# EAGLE schematic multiMicro_base_64pin (EAGLE 6.1)
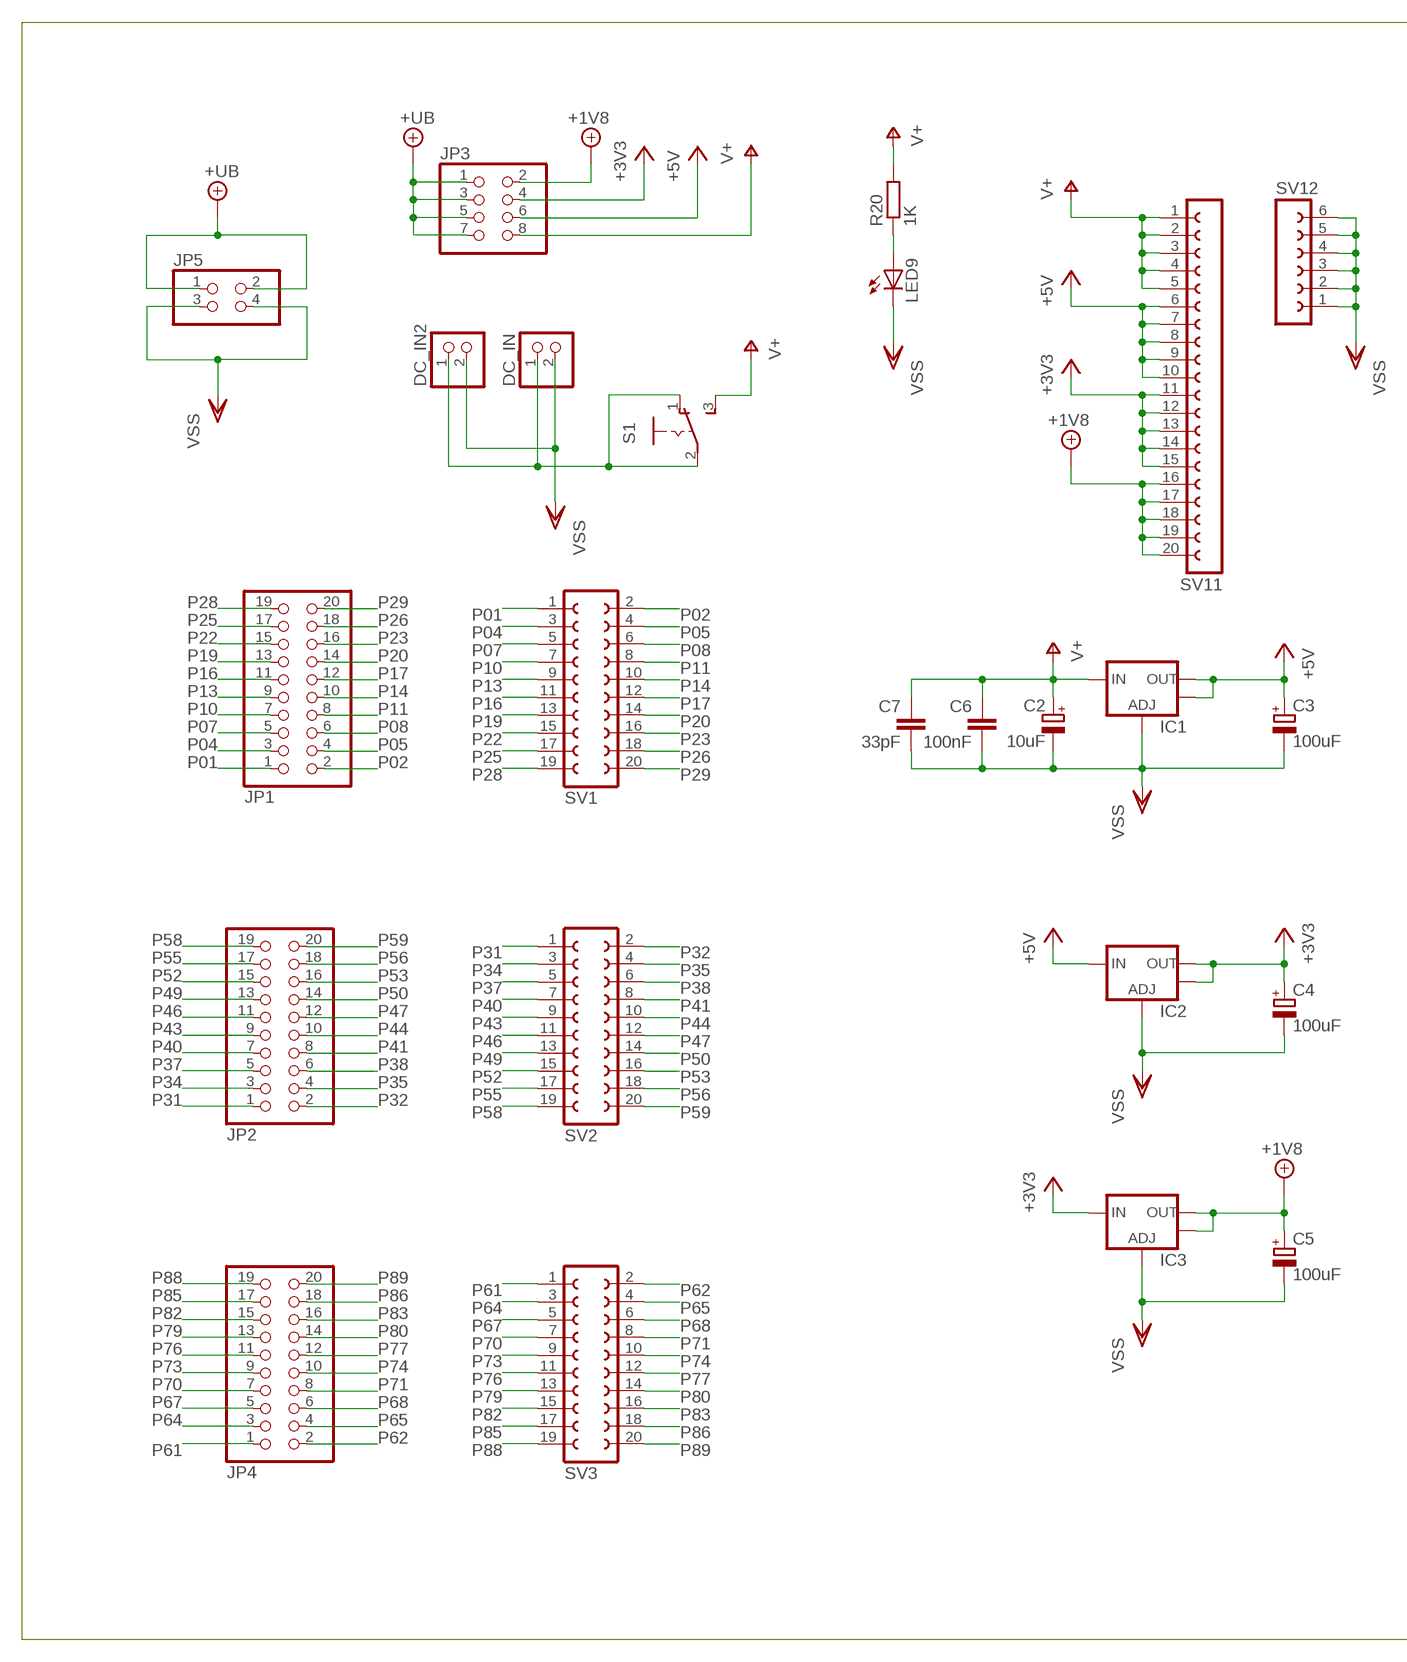
[diagram p0: schematic, sheet 1, part 1 of 2]
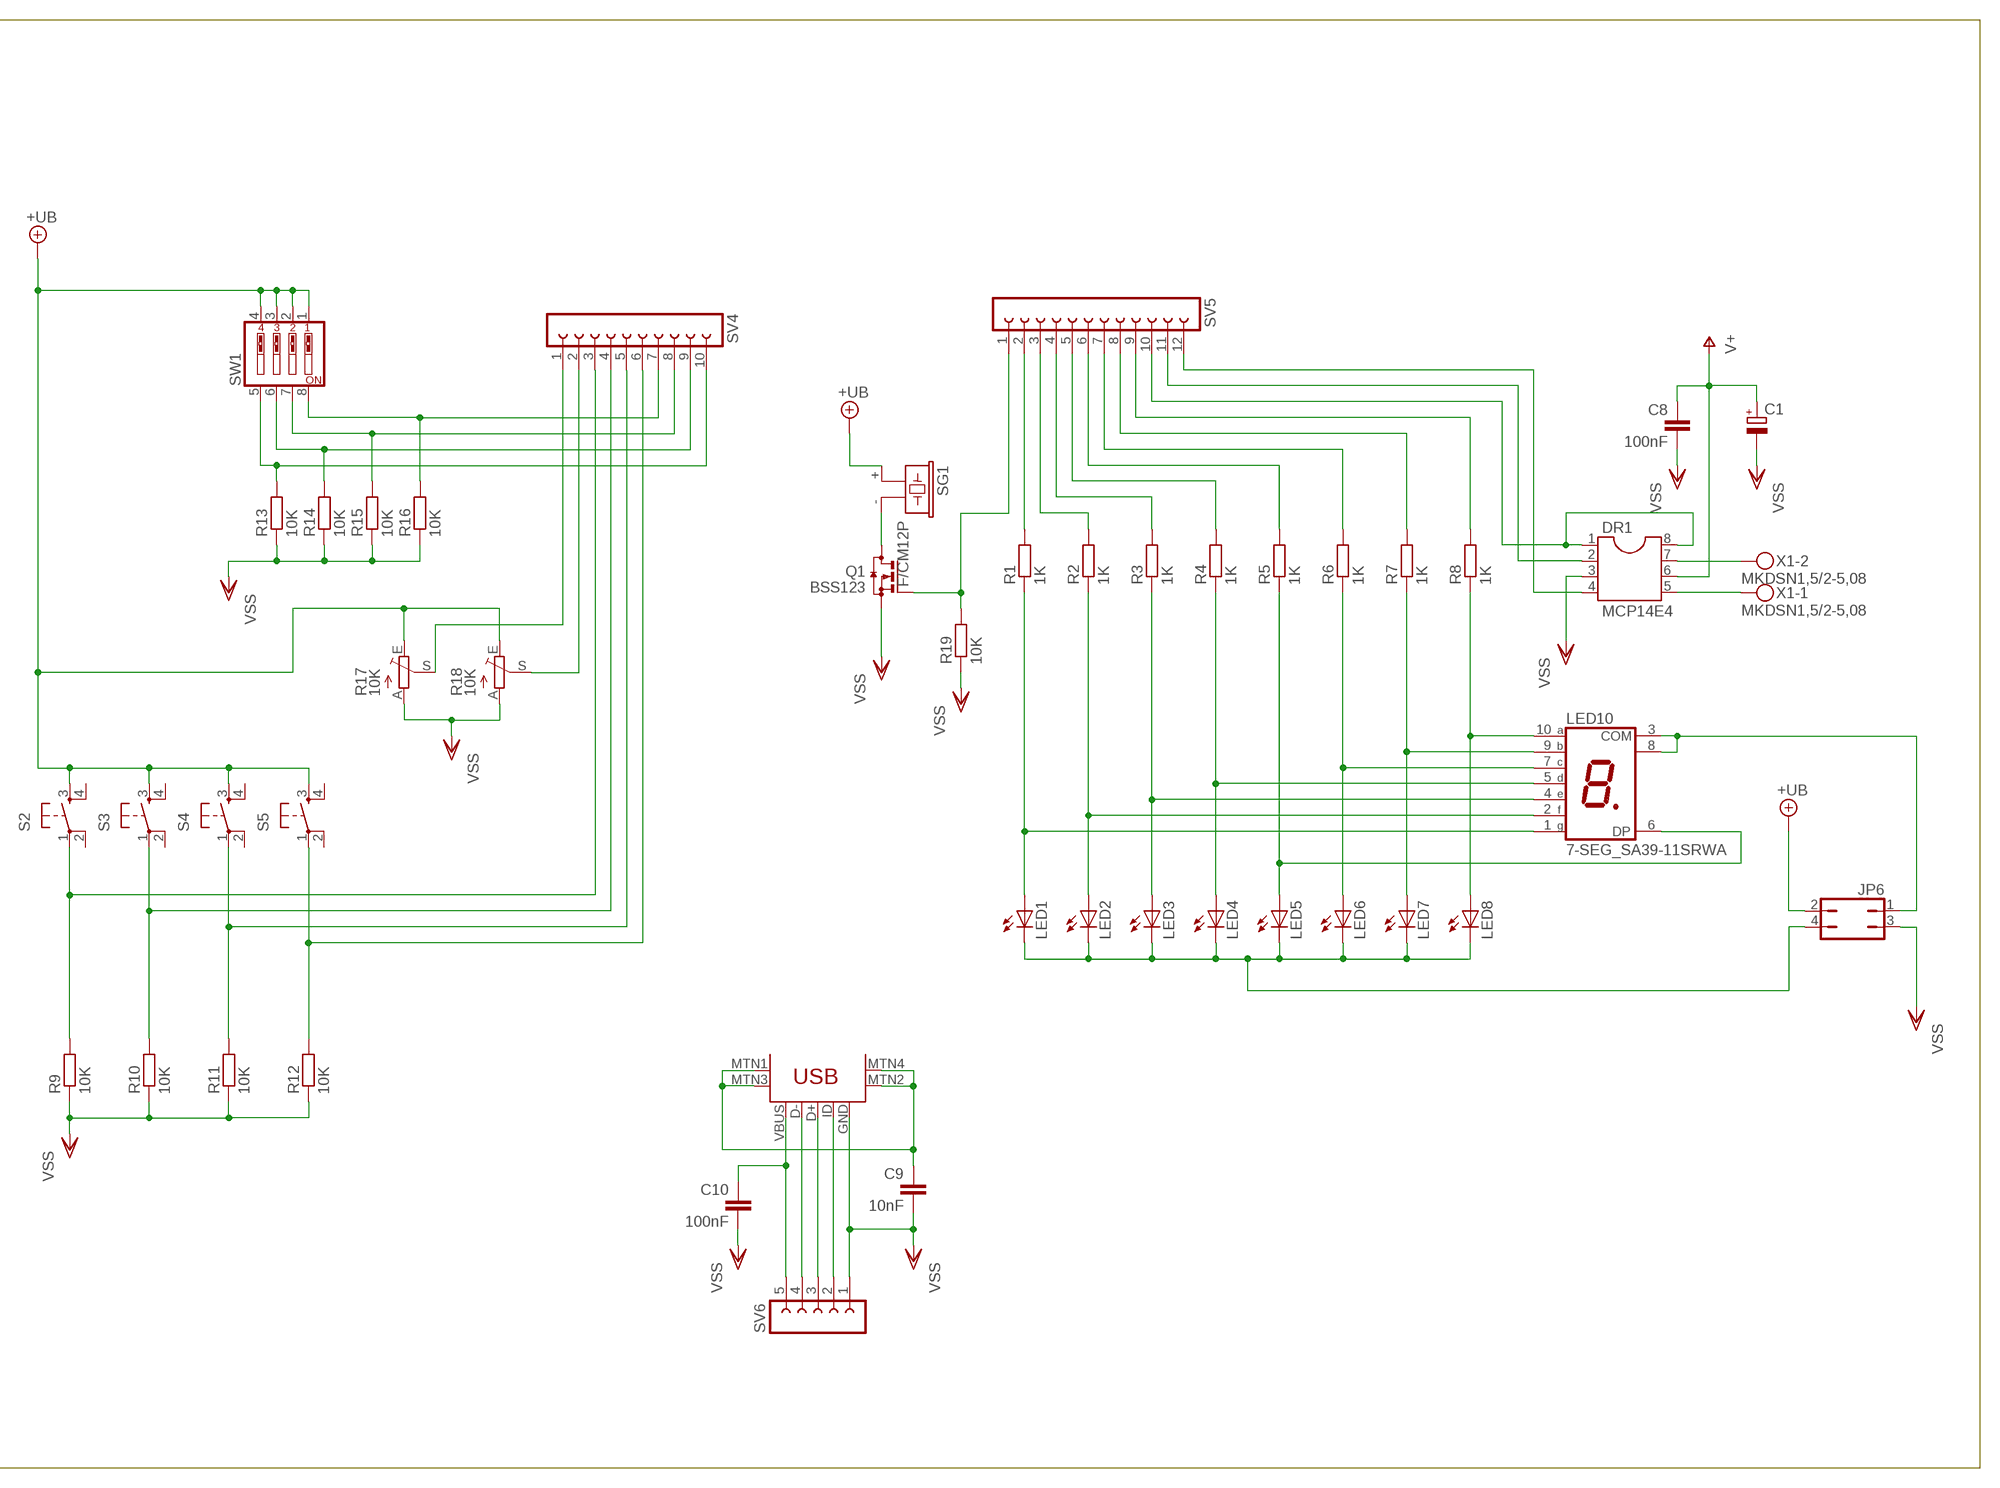
[diagram p1: schematic, sheet 1, part 2 of 2]

## Parts
C1  CPOL-EU140CLH-0810  [140CLH-0810]
C2  10uF  CPOL-EUSMCC  [SMC_C]
C3  100uF  CPOL-EUCT7343  [CT7343]
C4  100uF  CPOL-EUCT7343  [CT7343]
C5  100uF  CPOL-EUCT7343  [CT7343]
C6  100nF  C-EUC0805  [C0805]
C7  33pF  C-EUC0805  [C0805]
C8  100nF  C-EUC0805  [C0805]
C9  10nF  C-EUC0805  [C0805]
C10  100nF  C-EUC0805  [C0805]
DC_IN  PINHD-1X2/90  [1X02/90]
DC_IN2  PINHD-1X2/90  [1X02/90]
DR1  MCP14E4  SOIC08  [SOIC08]
IC1  V_REG_LM1117SOT223  [SOT223]
IC2  V_REG_LM1117SOT223  [SOT223]
IC3  V_REG_LM1117SOT223  [SOT223]
JP1  PINHD-2X10/90  [2X10/90]
JP2  PINHD-2X10/90  [2X10/90]
JP3  PINHD-2X4  [2X04]
JP4  PINHD-2X10/90  [2X10/90]
JP5  PINHD-2X2/90  [2X02/90]
JP6  JP2Q  [JP2Q]
LED1  LEDCHIP-LED0805  [CHIP-LED0805]
LED2  LEDCHIP-LED0805  [CHIP-LED0805]
LED3  LEDCHIP-LED0805  [CHIP-LED0805]
LED4  LEDCHIP-LED0805  [CHIP-LED0805]
LED5  LEDCHIP-LED0805  [CHIP-LED0805]
LED6  LEDCHIP-LED0805  [CHIP-LED0805]
LED7  LEDCHIP-LED0805  [CHIP-LED0805]
LED8  LEDCHIP-LED0805  [CHIP-LED0805]
LED9  LEDCHIP-LED0805  [CHIP-LED0805]
LED10  7-SEG_SA39-11SRWA  [SA39-11SRWA]
Q1  BSS123  [SOT23]
R1  1K  R-EU_R0805  [R0805]
R2  1K  R-EU_R0805  [R0805]
R3  1K  R-EU_R0805  [R0805]
R4  1K  R-EU_R0805  [R0805]
R5  1K  R-EU_R0805  [R0805]
R6  1K  R-EU_R0805  [R0805]
R7  1K  R-EU_R0805  [R0805]
R8  1K  R-EU_R0805  [R0805]
R9  10K  R-EU_R0805  [R0805]
R10  10K  R-EU_R0805  [R0805]
R11  10K  R-EU_R0805  [R0805]
R12  10K  R-EU_R0805  [R0805]
R13  10K  R-EU_R0805  [R0805]
R14  10K  R-EU_R0805  [R0805]
R15  10K  R-EU_R0805  [R0805]
R16  10K  R-EU_R0805  [R0805]
R17  10K  TRIM_EU-CA6V  [CA6V]
R18  10K  TRIM_EU-CA6V  [CA6V]
R19  10K  R-EU_R0805  [R0805]
R20  1K  R-EU_R0805  [R0805]
S1  255SB  [255SB]
S2  TAC_SWITCHPTH  [TACTILE-PTH]
S3  TAC_SWITCHPTH  [TACTILE-PTH]
S4  TAC_SWITCHPTH  [TACTILE-PTH]
S5  TAC_SWITCHPTH  [TACTILE-PTH]
SG1  F/CM12P  [F/CM12P]
SV1  FE10-2  [FE10-2]
SV2  FE10-2  [FE10-2]
SV3  FE10-2  [FE10-2]
SV4  FE10-1  [FE10]
SV5  FE12-1  [FE12]
SV6  FE05-1  [FE05-1]
SV11  FE20-1  [FE20]
SV12  FE06-1  [FE06]
SW1  SW_DIP-4  [EDG-04]
U$1  USB-MINIB-5PIN  [USB-MINIB]
X1  MKDSN1,5/2-5,08  [MKDSN1,5/2-5,08]

## Nets
+3V3: C4.+ IC2.2(OUT) IC2.4(OUT) IC3.3(IN) JP3.4 SV11.11 SV11.12 SV11.13 SV11.14 SV11.15
+5V: C3.+ IC1.2(OUT) IC1.4(OUT) IC2.3(IN) JP3.6 SV11.6 SV11.7 SV11.8 SV11.9 SV11.10
+18V: C5.+ IC3.2(OUT) IC3.4(OUT) JP3.2 SV11.16 SV11.17 SV11.18 SV11.19 SV11.20 ; supply symbol labelled +1V8
+UB: JP3.1 JP3.3 JP3.5 JP3.7 JP5.1 JP5.2 JP6.2 R17.E R18.E S2.3 S3.3 S4.3 S5.3 SG1.+ SW1.1 SW1.2 SW1.3 SW1.4
N$1: LED1.A LED10.1(G) R1.1
N$2: LED2.A LED10.2(F) R2.1
N$3: LED3.A LED10.4(E) R3.1
N$4: LED4.A LED10.5(D) R4.1
N$5: R2.2 SV5.3
N$6: R3.2 SV5.4
N$7: R1.2 SV5.2
N$8: R4.2 SV5.5
N$9: LED9.A R20.1
N$10: R18.S SV4.2
N$11: DR1.5 X1.1
N$12: DR1.7 X1.2
N$13: DR1.2 SV5.11
N$14: DR1.4 SV5.12
N$15: DR1.1 DR1.8 SV5.10
N$16: JP6.4 LED1.C LED2.C LED3.C LED4.C LED5.C LED6.C LED7.C LED8.C
N$17: JP6.1 LED10.3(COM) LED10.8(COM)
N$18: Q1.3(D) SG1.-
N$19: SV6.2 U$1.ID
N$20: LED5.A LED10.6(DP) R5.1
N$21: C9.1 U$1.MTN1(MTN2) U$1.MTN2(MTN3) U$1.MTN3(MTN1) U$1.MTN4
N$22: SV6.3 U$1.D+
N$23: SV6.4 U$1.D-
N$24: C10.1 SV6.5 U$1.VBUS
N$42: DC_IN2.1 DC_IN.1 S1.1(O) S1.2(P)
N$44: LED6.A LED10.7(C) R6.1
N$45: LED7.A LED10.9(B) R7.1
N$46: LED8.A LED10.10(A) R8.1
N$47: R9.2 S2.1 SV4.3
N$48: R10.2 S3.1 SV4.4
N$49: R11.2 S4.1 SV4.5
N$50: R12.2 S5.1 SV4.6
N$55: Q1.1(G) R19.2 SV5.1
N$57: R17.S SV4.1
N$62: R6.2 SV5.7
N$63: R7.2 SV5.8
N$64: R5.2 SV5.6
N$65: R8.2 SV5.9
N$147: R13.2 SV4.10 SW1.5
N$148: R14.2 SV4.9 SW1.6
N$149: R15.2 SV4.8 SW1.7
N$150: R16.2 SV4.7 SW1.8
P01: JP1.1 SV1.1
P02: JP1.2 SV1.2
P04: JP1.3 SV1.3
P05: JP1.4 SV1.4
P07: JP1.5 SV1.5
P08: JP1.6 SV1.6
P10: JP1.7 SV1.7
P11: JP1.8 SV1.8
P13: JP1.9 SV1.9
P14: JP1.10 SV1.10
P16: JP1.11 SV1.11
P17: JP1.12 SV1.12
P19: JP1.13 SV1.13
P20: JP1.14 SV1.14
P22: JP1.15 SV1.15
P23: JP1.16 SV1.16
P25: JP1.17 SV1.17
P26: JP1.18 SV1.18
P28: JP1.19 SV1.19
P29: JP1.20 SV1.20
P31: JP2.1 SV2.1
P32: JP2.2 SV2.2
P34: JP2.3 SV2.3
P35: JP2.4 SV2.4
P37: JP2.5 SV2.5
P38: JP2.6 SV2.6
P40: JP2.7 SV2.7
P41: JP2.8 SV2.8
P43: JP2.9 SV2.9
P44: JP2.10 SV2.10
P46: JP2.11 SV2.11
P47: JP2.12 SV2.12
P49: JP2.13 SV2.13
P50: JP2.14 SV2.14
P52: JP2.15 SV2.15
P53: JP2.16 SV2.16
P55: JP2.17 SV2.17
P56: JP2.18 SV2.18
P58: JP2.19 SV2.19
P59: JP2.20 SV2.20
P61: JP4.1 SV3.1
P62: JP4.2 SV3.2
P64: JP4.3 SV3.3
P65: JP4.4 SV3.4
P67: JP4.5 SV3.5
P68: JP4.6 SV3.6
P70: JP4.7 SV3.7
P71: JP4.8 SV3.8
P73: JP4.9 SV3.9
P74: JP4.10 SV3.10
P76: JP4.11 SV3.11
P77: JP4.12 SV3.12
P79: JP4.13 SV3.13
P80: JP4.14 SV3.14
P82: JP4.15 SV3.15
P83: JP4.16 SV3.16
P85: JP4.17 SV3.17
P86: JP4.18 SV3.18
P88: JP4.19 SV3.19
P89: JP4.20 SV3.20
V+: C1.+ C2.+ C6.1 C7.1 C8.1 DR1.6 IC1.3(IN) JP3.8 R20.2 S1.3(S) SV11.1 SV11.2 SV11.3 SV11.4 SV11.5
VSS: C1.- C2.- C3.- C4.- C5.- C6.2 C7.2 C8.2 C9.2 C10.2 DC_IN2.2 DC_IN.2 DR1.3 IC1.1(ADJ) IC2.1(ADJ) IC3.1(ADJ) JP5.3 JP5.4 JP6.3 LED9.C Q1.2(S) R9.1 R10.1 R11.1 R12.1 R13.1 R14.1 R15.1 R16.1 R17.A R18.A R19.1 SV6.1 SV12.1 SV12.2 SV12.3 SV12.4 SV12.5 SV12.6 U$1.GND
Unconnected: S2.2 S2.4 S3.2 S3.4 S4.2 S4.4 S5.2 S5.4

## Library data of the parts
C1-C5 = rcl:CPOL-EU: POLARIZED CAPACITOR, European symbol
C6-C10 = rcl:C-EU: CAPACITOR, European symbol
DC_IN DC_IN2 = pinhead:PINHD-1X2: PIN HEADER
DR1 = ic-package:SOIC08
IC1-IC3 = SparkFun:V_REG_LM1117: Voltage Regulator LM1117 Standard adjustable voltage regulator but in SMD form. Spark Fun Electronics SKU : COM-00595
JP1 JP2 JP4 = pinhead:PINHD-2X10: PIN HEADER
JP3 = pinhead:PINHD-2X4: PIN HEADER
JP5 = pinhead:PINHD-2X2: PIN HEADER
JP6 = jumper:JP2Q: JUMPER
LED1-LED9 = led:LED: LED OSRAM: - CHIPLED LG R971, LG N971, LY N971, LG Q971, LY Q971, LO R971, LY R971 LH N974, LH R974 LS Q976, LO Q976, LY Q976 LO Q996 - Hyper CHIPLED LW Q18S LB Q993, LB Q99A, LB R99A - SideLED LS A670, LO A670, LY A670, LG A670, LP A670 LB A673, LV A673, LT A673, LW A673 LH A674 LY A675 LS A676, LA A676, LO A676, LY A676, LW A676 LS A679, LY A679, LG A679 - Hyper Micro SIDELED® LS Y876, LA Y876, LO Y876, LY Y876 LT Y87S - SmartLED LW L88C, LW L88S LB L89C, LB L89S, LG L890 LS L89K, LO L89K, LY L89K LS L896, LA L896, LO L896, LY L896 - TOPLED LS T670, LO T670, LY T670, LG T670, LP T670 LSG T670, LSP T670, LSY T670, LOP T670, LYG T670 LG T671, LOG T671, LSG T671 LB T673, LV T673, LT T673, LW T673 LH T674 LS T676, LA T676, LO T676, LY T676, LB T676, LH T676, LSB T676, LW T676 LB T67C, LV T67C, LT T67C, LS T67K, LO T67K, LY T67K, LW E67C LS E67B, LA E67B, LO E67B, LY E67B, LB E67C, LV E67C, LT E67C LW T67C LS T679, LY T679, LG T679 LS T770, LO T770, LY T770, LG T770, LP T770 LB T773, LV T773, LT T773, LW T773 LH T774 LS E675, LA E675, LY E675, LS T675 LS T776, LA T776, LO T776, LY T776, LB T776 LHGB T686 LT T68C, LB T68C - Hyper Mini TOPLED® LB M676 - Mini TOPLED Santana® LG M470 LS M47K, LO M47K, LY M47K Source: http://www.osram.convergy.de LUXEON: - LUMILED® LXK2-PW12-R00, LXK2-PW12-S00, LXK2-PW14-U00, LXK2-PW14-V00 LXK2-PM12-R00, LXK2-PM12-S00, LXK2-PM14-U00 LXK2-PE12-Q00, LXK2-PE12-R00, LXK2-PE12-S00, LXK2-PE14-T00, LXK2-PE14-U00 LXK2-PB12-K00, LXK2-PB12-L00, LXK2-PB12-M00, LXK2-PB14-N00, LXK2-PB14-P00, LXK2-PB14-Q00 LXK2-PR12-L00, LXK2-PR12-M00, LXK2-PR14-Q00, LXK2-PR14-R00 LXK2-PD12-Q00, LXK2-PD12-R00, LXK2-PD12-S00 LXK2-PH12-R00, LXK2-PH12-S00 LXK2-PL12-P00, LXK2-PL12-Q00, LXK2-PL12-R00 Source: www.luxeon.com KINGBRIGHT: KA-3528ASYC Source: www.kingbright.com
LED10 = display-kingbright:7-SEG_: Kingbright 14.2mm (0.56 INCH) SINGLE DIGIT NUMERIC DUISPLAY Source: SA56-11EWA(Ver1189471036.pdf; OC_FARNELL: unknown; OC_NEWARK: unknown
Q1 = transistor-small-signal:BSS123: N-CHANNEL MOS FET
R1-R16 R19 R20 = rcl:R-EU_: RESISTOR, European symbol
R17 R18 = pot:TRIM_EU-: POTENTIOMETER
S1 = switch:255SB: SLIDING SWITCH Distributor Buerklin, 11G810
S2-S5 = SparkFun:TAC_SWITCH: Momentary Switch Button commonly used for reset or general input. Spark Fun Electronics SKU : COM-00097
SG1 = buzzer:F/CM12P: BUZZER Source: Buerklin; OC_FARNELL: unknown; OC_NEWARK: unknown
SV1-SV3 = con-lsta:FE10-2: FEMALE HEADER; OC_FARNELL: unknown; OC_NEWARK: unknown
SV4 = con-lsta:FE10-1: FEMALE HEADER; OC_FARNELL: unknown; OC_NEWARK: unknown
SV5 = con-lsta:FE12-1: FEMALE HEADER; OC_FARNELL: unknown; OC_NEWARK: unknown
SV6 = con-lsta:FE05-1: FEMALE HEADER; OC_FARNELL: unknown; OC_NEWARK: unknown
SV11 = con-lsta:FE20-1: FEMALE HEADER; OC_FARNELL: unknown; OC_NEWARK: unknown
SV12 = con-lsta:FE06-1: FEMALE HEADER; OC_FARNELL: unknown; OC_NEWARK: unknown
SW1 = special:SW_DIP-4: DIP SWITCH
U$1 = SparkFun-Connectors:USB-MINIB: Mini-USB "B" connector with 5th pin broken out. Created new symbol breaking out 5th "ID" pin in mini/micro USB connector spec. See: http://en.wikipedia.org/wiki/Mini_usb#Cables. Uses same footprint as 4-pin symbol. Also added pins to connect to mounting / shield pads if required (probably not generally needed as signals aren't shielded once they leave the connector).
X1 = con-phoenix-508:MKDSN1,5/2-5,08: MKDSN 1,5/ 2-5,08 Printklemme Nennstrom: 13,5 A Nennspannung: 250 V Rastermaß: 5,08 mm Polzahl: 2 Anschlussart: Schraubanschluss Montage: Löten Anschlussrichtung Leiter/Platine: 0 ° Artikelnummer: 1729128 Source: http://eshop.phoenixcontact.com .. 1729128.pdf; MPN: MKDSN 1,5/2-5.08; OC_FARNELL: 1792903; OC_NEWARK: 30M2397